# EAGLE design atx-breakout (EAGLE 9.6.2)
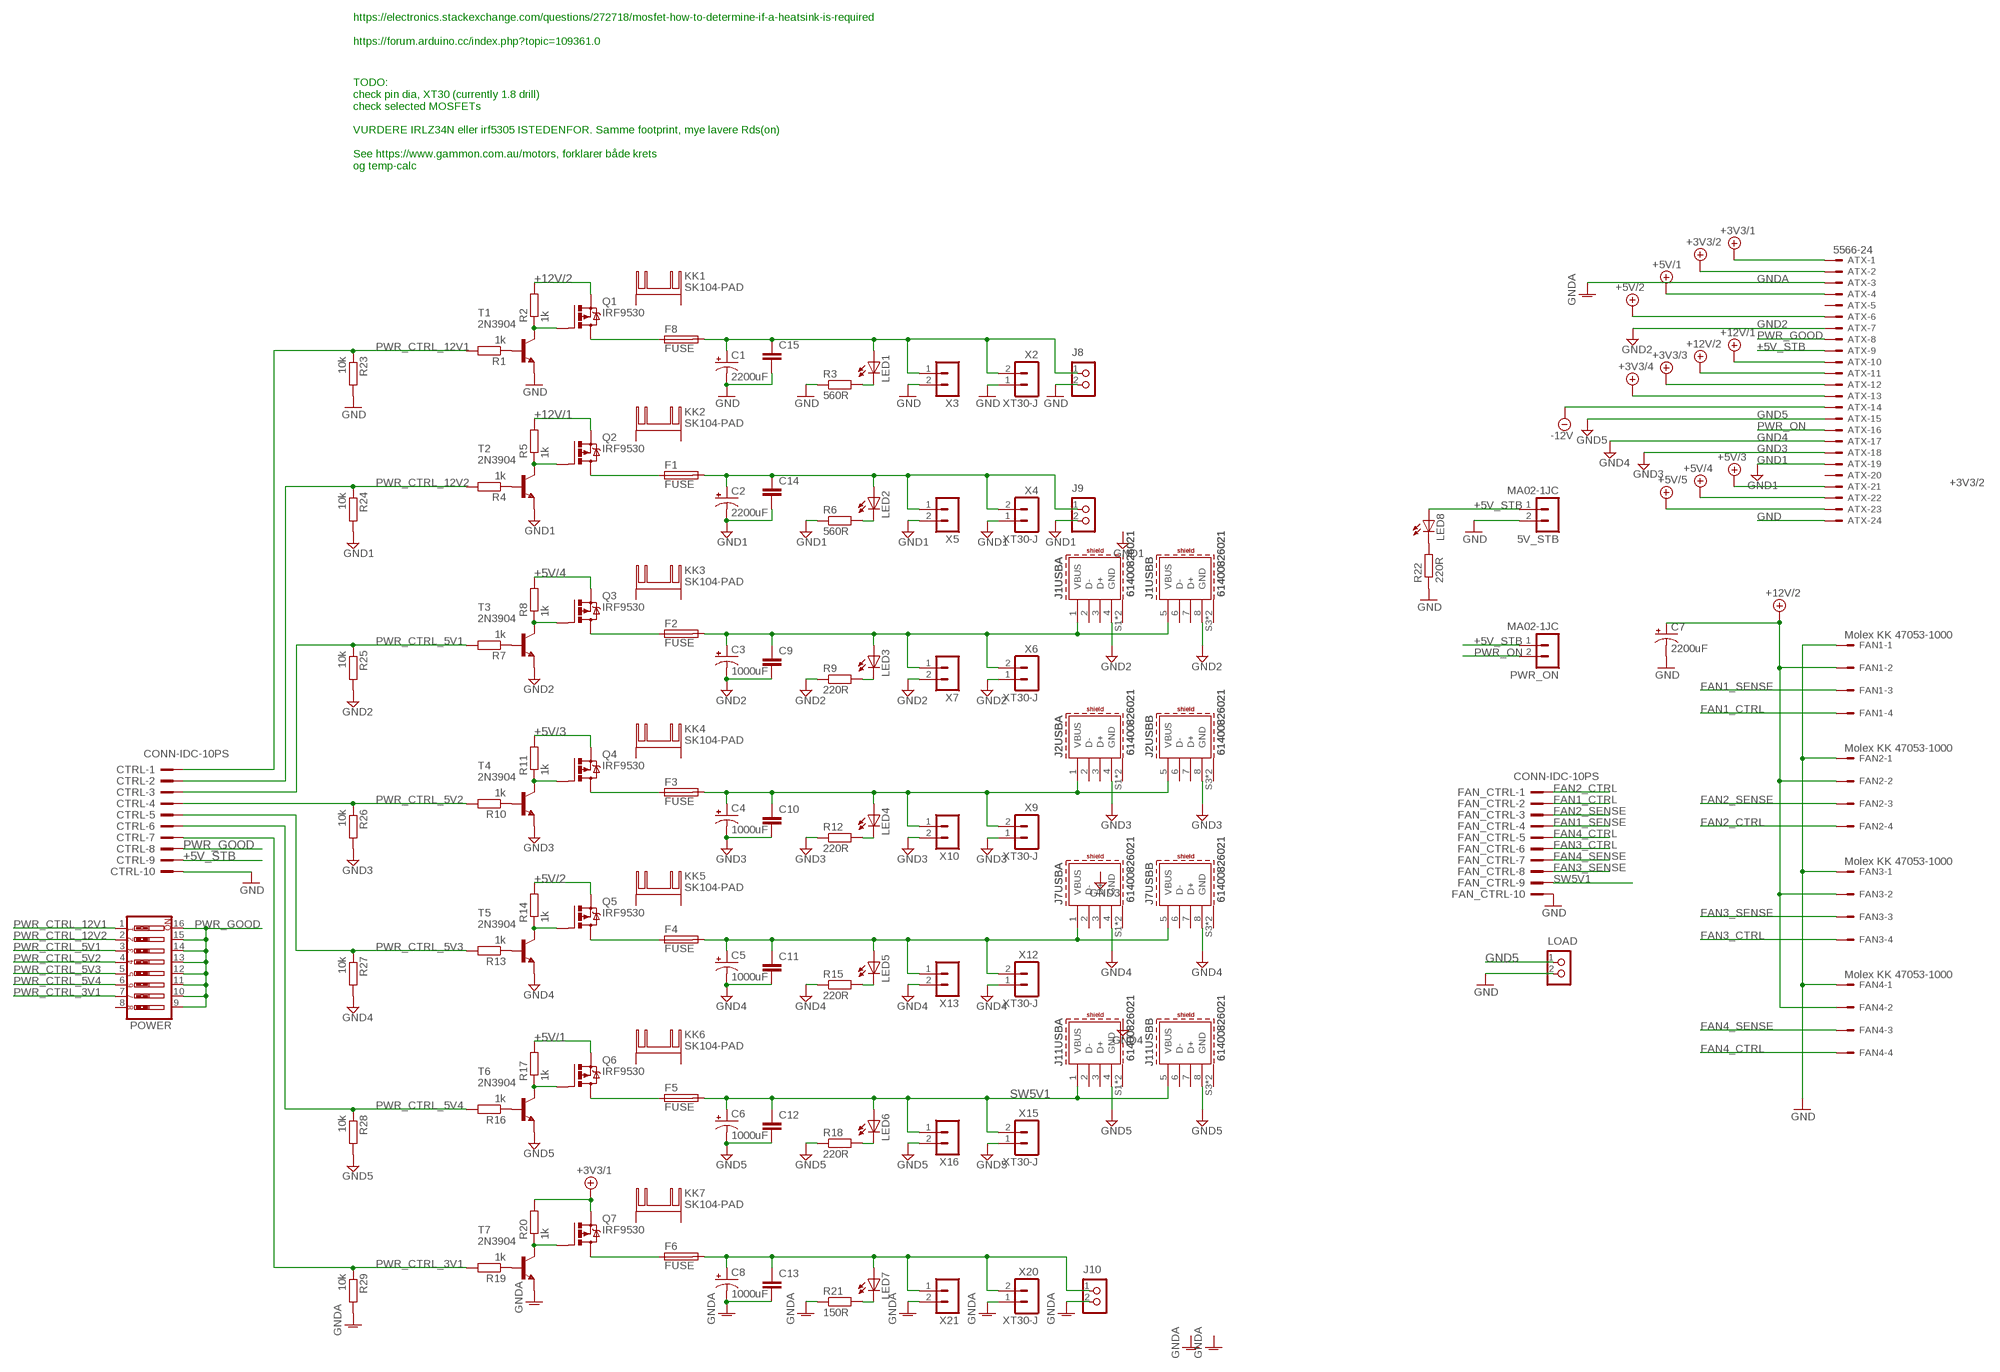
[diagram p0: schematic, sheet 1]

## Parts
5V_STB  MA02-1JC  [MA02-1J]
ATX  5566-24  [5566-24]
C1  2200uF  CPOL-USE7.5-16  [E7,5-16]
C2  2200uF  CPOL-USE7.5-16  [E7,5-16]
C3  1000uF  CPOL-USE5-10.5  [E5-10,5]
C4  1000uF  CPOL-USE5-10.5  [E5-10,5]
C5  1000uF  CPOL-USE5-10.5  [E5-10,5]
C6  1000uF  CPOL-USE5-10.5  [E5-10,5]
C7  2200uF  CPOL-USE7.5-16  [E7,5-16]
C8  1000uF  CPOL-USE5-10.5  [E5-10,5]
C9  C-EU050-030X075  [C050-030X075]
C10  C-EU050-030X075  [C050-030X075]
C11  C-EU050-030X075  [C050-030X075]
C12  C-EU050-030X075  [C050-030X075]
C13  C-EU050-030X075  [C050-030X075]
C14  C-EU050-030X075  [C050-030X075]
C15  C-EU050-030X075  [C050-030X075]
CTRL  CONN-IDC-10PS  [CONN-IDC10P-S]
F1  FUSE  FUSEBLANK_5X20MM  [FUSE_HOLDER_5X20MM]
F2  FUSE  FUSEBLANK_5X20MM  [FUSE_HOLDER_5X20MM]
F3  FUSE  FUSEBLANK_5X20MM  [FUSE_HOLDER_5X20MM]
F4  FUSE  FUSEBLANK_5X20MM  [FUSE_HOLDER_5X20MM]
F5  FUSE  FUSEBLANK_5X20MM  [FUSE_HOLDER_5X20MM]
F6  FUSE  FUSEBLANK_5X20MM  [FUSE_HOLDER_5X20MM]
F8  FUSE  FUSEBLANK_5X20MM  [FUSE_HOLDER_5X20MM]
FAN1  Molex KK 47053-1000  22-27-2041-04  [6410-04]
FAN2  Molex KK 47053-1000  22-27-2041-04  [6410-04]
FAN3  Molex KK 47053-1000  22-27-2041-04  [6410-04]
FAN4  Molex KK 47053-1000  22-27-2041-04  [6410-04]
FAN_CTRL  CONN-IDC-10PS  [CONN-IDC10P-S]
J1  61400826021  61400826021  [61400826021]
J2  61400826021  61400826021  [61400826021]
J7  61400826021  61400826021  [61400826021]
J8  CON_TERMINAL_BLOCK_02-5MM  [TERMINAL_BLOCK_2P_5]
J9  CON_TERMINAL_BLOCK_02-5MM  [TERMINAL_BLOCK_2P_5]
J10  CON_TERMINAL_BLOCK_02-5MM  [TERMINAL_BLOCK_2P_5]
J11  61400826021  61400826021  [61400826021]
KK1  SK104-PAD  [SK104-PAD]
KK2  SK104-PAD  [SK104-PAD]
KK3  SK104-PAD  [SK104-PAD]
KK4  SK104-PAD  [SK104-PAD]
KK5  SK104-PAD  [SK104-PAD]
KK6  SK104-PAD  [SK104-PAD]
KK7  SK104-PAD  [SK104-PAD]
LED1  LED_J3MM  [LED3MM]
LED2  LED_J3MM  [LED3MM]
LED3  LED_J3MM  [LED3MM]
LED4  LED_J3MM  [LED3MM]
LED5  LED_J3MM  [LED3MM]
LED6  LED_J3MM  [LED3MM]
LED7  LED_J3MM  [LED3MM]
LED8  LED_J3MM  [LED3MM]
LOAD  CON_TERMINAL_BLOCK_02-5MM  [TERMINAL_BLOCK_2P_5]
POWER  SW_DIP-8  [EDG-08]
PWR_ON  MA02-1JC  [MA02-1J]
Q1  IRF9530  [TO220BV]
Q2  IRF9530  [TO220BV]
Q3  IRF9530  [TO220BV]
Q4  IRF9530  [TO220BV]
Q5  IRF9530  [TO220BV]
Q6  IRF9530  [TO220BV]
Q7  IRF9530  [TO220BV]
R1  1k  R-EU_0207/7  [0207/7]
R2  1k  R-EU_0207/7  [0207/7]
R3  560R  R-EU_0207/7  [0207/7]
R4  1k  R-EU_0207/7  [0207/7]
R5  1k  R-EU_0207/7  [0207/7]
R6  560R  R-EU_0207/7  [0207/7]
R7  1k  R-EU_0207/7  [0207/7]
R8  1k  R-EU_0207/7  [0207/7]
R9  220R  R-EU_0207/7  [0207/7]
R10  1k  R-EU_0207/7  [0207/7]
R11  1k  R-EU_0207/7  [0207/7]
R12  220R  R-EU_0207/7  [0207/7]
R13  1k  R-EU_0207/7  [0207/7]
R14  1k  R-EU_0207/7  [0207/7]
R15  220R  R-EU_0207/7  [0207/7]
R16  1k  R-EU_0207/7  [0207/7]
R17  1k  R-EU_0207/7  [0207/7]
R18  220R  R-EU_0207/7  [0207/7]
R19  1k  R-EU_0207/7  [0207/7]
R20  1k  R-EU_0207/7  [0207/7]
R21  150R  R-EU_0207/7  [0207/7]
R22  220R  R-EU_0207/7  [0207/7]
R23  10k  R-EU_0207/7  [0207/7]
R24  10k  R-EU_0207/7  [0207/7]
R25  10k  R-EU_0207/7  [0207/7]
R26  10k  R-EU_0207/7  [0207/7]
R27  10k  R-EU_0207/7  [0207/7]
R28  10k  R-EU_0207/7  [0207/7]
R29  10k  R-EU_0207/7  [0207/7]
T1  2N3904  [TO92]
T2  2N3904  [TO92]
T3  2N3904  [TO92]
T4  2N3904  [TO92]
T5  2N3904  [TO92]
T6  2N3904  [TO92]
T7  2N3904  [TO92]
X2  XT30-J  [XT30-J]
X3  MA02-1JC  [MA02-1J]
X4  XT30-J  [XT30-J]
X5  MA02-1JC  [MA02-1J]
X6  XT30-J  [XT30-J]
X7  MA02-1JC  [MA02-1J]
X9  XT30-J  [XT30-J]
X10  MA02-1JC  [MA02-1J]
X12  XT30-J  [XT30-J]
X13  MA02-1JC  [MA02-1J]
X15  XT30-J  [XT30-J]
X16  MA02-1JC  [MA02-1J]
X20  XT30-J  [XT30-J]
X21  MA02-1JC  [MA02-1J]

## Nets
+3V3/1: ATX.1 Q7.S R20.2
+3V3/2: ATX.2
+3V3/3: ATX.12
+3V3/4: ATX.13
+5V: ATX.23 ; supply symbol labelled +5V/5
+5V/1: ATX.4 Q6.S R17.2
+5V/2: ATX.6 Q5.S R14.2
+5V/3: ATX.21 Q4.S R11.2
+5V/4: ATX.22 Q3.S R8.2
+5V_STB: 5V_STB.1 ATX.9 CTRL.9 LED8.A PWR_ON.1
+12V/1: ATX.10 Q2.S R5.2
+12V/2: ATX.11 C7.+ FAN1.2 FAN2.2 FAN3.2 FAN4.2 Q1.S R2.2
-12V: ATX.14
FAN1_CTRL: FAN1.4 FAN_CTRL.2
FAN1_SENSE: FAN1.3 FAN_CTRL.4
FAN2_CTRL: FAN2.4 FAN_CTRL.1
FAN2_SENSE: FAN2.3 FAN_CTRL.3
FAN3_CTRL: FAN3.4 FAN_CTRL.6
FAN3_SENSE: FAN3.3 FAN_CTRL.8
FAN4_CTRL: FAN4.4 FAN_CTRL.5
FAN4_SENSE: FAN4.3 FAN_CTRL.7
GND: 5V_STB.2 ATX.24 C1.- C7.- C15.2 CTRL.10 FAN1.1 FAN2.1 FAN3.1 FAN4.1 FAN_CTRL.10 J8.2 LOAD.2 R3.1 R22.1 R23.2 T1.3(E) X2.1 X3.2
GND1: ATX.19 C2.- C14.2 J9.2 R6.1 R24.2 T2.3(E) X4.1 X5.2
GND2: ATX.7 C3.- C9.2 J1.4(USBA:GND) J1.8(USBB:GND) R9.1 R25.2 T3.3(E) X6.1 X7.2
GND3: ATX.18 C4.- C10.2 J2.4(USBA:GND) J2.8(USBB:GND) R12.1 R26.2 T4.3(E) X9.1 X10.2
GND4: ATX.17 C5.- C11.2 J7.4(USBA:GND) J7.8(USBB:GND) R15.1 R27.2 T5.3(E) X12.1 X13.2
GND5: ATX.15 C6.- C12.2 J11.4(USBA:GND) J11.8(USBB:GND) LOAD.1 R18.1 R28.2 T6.3(E) X15.1 X16.2
GNDA: ATX.3 C8.- C13.2 J10.2 R21.1 R29.2 T7.3(E) X20.1 X21.2
N$1: R1.1 T1.2(B)
N$2: Q1.G R2.1 T1.1(C)
N$3: LED8.K(C) R22.2
N$4: C1.+ C15.1 F8.2 J8.1 LED1.A X2.2 X3.1
N$5: LED1.K(C) R3.2
N$6: F8.1 Q1.D
N$7: R4.1 T2.2(B)
N$8: Q2.G R5.1 T2.1(C)
N$9: C2.+ C14.1 F1.2 J9.1 LED2.A X4.2 X5.1
N$10: LED2.K(C) R6.2
N$11: F1.1 Q2.D
N$12: R7.1 T3.2(B)
N$13: Q3.G R8.1 T3.1(C)
N$14: C3.+ C9.1 F2.2 J1.1(USBA:VBUS) J1.5(USBB:VBUS) LED3.A X6.2 X7.1
N$15: LED3.K(C) R9.2
N$16: F2.1 Q3.D
N$17: R10.1 T4.2(B)
N$18: Q4.G R11.1 T4.1(C)
N$19: C4.+ C10.1 F3.2 J2.1(USBA:VBUS) J2.5(USBB:VBUS) LED4.A X9.2 X10.1
N$20: LED4.K(C) R12.2
N$21: F3.1 Q4.D
N$22: R13.1 T5.2(B)
N$23: Q5.G R14.1 T5.1(C)
N$24: C5.+ C11.1 F4.2 J7.1(USBA:VBUS) J7.5(USBB:VBUS) LED5.A X12.2 X13.1
N$25: LED5.K(C) R15.2
N$26: F4.1 Q5.D
N$27: R16.1 T6.2(B)
N$28: Q6.G R17.1 T6.1(C)
N$30: LED6.K(C) R18.2
N$31: F5.1 Q6.D
N$33: R19.1 T7.2(B)
N$34: Q7.G R20.1 T7.1(C)
N$35: C8.+ C13.1 F6.2 J10.1 LED7.A X20.2 X21.1
N$36: LED7.K(C) R21.2
N$37: F6.1 Q7.D
PWR_CTRL_3V1: CTRL.7 POWER.7 R19.2 R29.1
PWR_CTRL_5V1: CTRL.3 POWER.3 R7.2 R25.1
PWR_CTRL_5V2: CTRL.4 POWER.4 R10.2 R26.1
PWR_CTRL_5V3: CTRL.5 POWER.5 R13.2 R27.1
PWR_CTRL_5V4: CTRL.6 POWER.6 R16.2 R28.1
PWR_CTRL_12V1: CTRL.1 POWER.1 R1.2 R23.1
PWR_CTRL_12V2: CTRL.2 POWER.2 R4.2 R24.1
PWR_GOOD: ATX.8 CTRL.8 POWER.9 POWER.10 POWER.11 POWER.12 POWER.13 POWER.14 POWER.15 POWER.16
PWR_ON: ATX.16 PWR_ON.2
SW5V1: C6.+ C12.1 F5.2 FAN_CTRL.9 J11.1(USBA:VBUS) J11.5(USBB:VBUS) LED6.A X15.2 X16.1
Unconnected: ATX.5 ATX.20 J1.2(USBA:D-) J1.3(USBA:D+) J1.6(USBB:D-) J1.7(USBB:D+) J1.S1(USBA:SHIELD) J1.S2(USBA:SHIELD) J1.S3(USBB:SHIELD) J1.S4(USBB:SHIELD) J2.2(USBA:D-) J2.3(USBA:D+) J2.6(USBB:D-) J2.7(USBB:D+) J2.S1(USBA:SHIELD) J2.S2(USBA:SHIELD) J2.S3(USBB:SHIELD) J2.S4(USBB:SHIELD) J7.2(USBA:D-) J7.3(USBA:D+) J7.6(USBB:D-) J7.7(USBB:D+) J7.S1(USBA:SHIELD) J7.S2(USBA:SHIELD) J7.S3(USBB:SHIELD) J7.S4(USBB:SHIELD) J11.2(USBA:D-) J11.3(USBA:D+) J11.6(USBB:D-) J11.7(USBB:D+) J11.S1(USBA:SHIELD) J11.S2(USBA:SHIELD) J11.S3(USBB:SHIELD) J11.S4(USBB:SHIELD) KK1.K1(K) KK1.K2(K) KK2.K1(K) KK2.K2(K) KK3.K1(K) KK3.K2(K) KK4.K1(K) KK4.K2(K) KK5.K1(K) KK5.K2(K) KK6.K1(K) KK6.K2(K) KK7.K1(K) KK7.K2(K) POWER.8

## Notes on the sheet
- https://electronics.stackexchange.com/questions/272718/mosfet-how-to-determine-if-a-heatsink-is-required
  
  https://forum.arduino.cc/index.php?topic=109361.0
- TODO:
  check pin dia, XT30 (currently 1.8 drill)
  check selected MOSFETs
  
  VURDERE IRLZ34N eller irf5305 ISTEDENFOR. Samme footprint, mye lavere Rds(on)
  
  See https://www.gammon.com.au/motors, forklarer både krets 
  og temp-calc

## Library data of the parts
5V_STB PWR_ON X3 X5 X7 X10 X13 X16 X21 = joakim:MA02-1J
ATX = con-molex:5566-24: Mini FIT connector 24 pol Source: http://www.molex.com; MF: MOLEX; OC_FARNELL: unknown; OC_NEWARK: unknown
C1-C8 = rcl:CPOL-US: POLARIZED CAPACITOR, American symbol; SPICEPREFIX: C
C9-C15 = rcl:C-EU: CAPACITOR, European symbol; SPICEPREFIX: C
CTRL FAN_CTRL = joakim:CONN-IDC-10P: 10P IDC Header
F1-F6 F8 = fuse:FUSE: Fuse; OC_FARNELL: unknown; OC_NEWARK: unknown
FAN1-FAN4 = con-molex:22-?-04: CONNECTOR wire to board 2.54 mm (.1 inch) pitch header; MF: MOLEX; OC_FARNELL: unknown; OC_NEWARK: unknown
J1 J2 J7 J11 = Wurth_Connectors_WR-USB:61400826021: WR-COM USB 2.0 Type A Horizontal Dual Stacked Kind Properties Durability:1 500 Mating cycles Quality Class:1 500 Mating cycles Connector Type:USB Gender:Receptacle Type:Stacked Horizontal General Information Operating Temperature:-40up to +105 °C Compliance:RoHS Electrical Properties IR 1:1.5 A Working Voltage:30V (AC) Withstanding Voltage:750 V (AC) Contact Resistance:20 mΩ Material Properties Insulator Material:PBT Insulator Flammability Rating:UL94 V-0 Color:White Cover Material:Brass Cover Plating:Nickel Contact Material:Copper Alloy Contact Plating:Selective Gold Contact Type:Stamped Shielding Material:Brass Shielding Plating:Nickel <https://www.we-online.com/catalog/media/o32989v209%20Family_WR-COM_61400826021.jpg> Details see: https://www.we-online.com/catalog/en/COM_TYPE_A_HORIZONTAL_DUAL_STACKED/ Updated by Yingchun, Shan 2020-01-14 2020 (C) Würth Elektronik; APPLICATION: USB 2.0; DATASHEET-URL: https://www.we-online.com/catalog/datasheet/61400826021.pdf; GERDER: Receptacle; INTERFACE-TYPE: Type A; IR1: 1.5A; MOUNT: THT; PACKAGING: Tray; PART-NUMBER: 61400826021; PINS: 8; TYPE: Stacked Horizontal; WORKING-VOLTAGE: 30V(AC)
J8-J10 LOAD = dp_devices.v6:CON_TERMINAL_BLOCK_02: 2 poles wire to board terminal block
KK1-KK7 = heatsink:SK104-PAD: HEATSINK manufacturer Fischer/distributor Buerklin
LED1-LED8 = joakim:LED_J: LED Everlight: rectangular 2 x 4 mm, 594
POWER = special:SW_DIP-8: DIP SWITCH
Q1-Q7 = transistor-power:IRF9530: P-CHANNEL HEXFET POWER-MOS-FET Source: http://www.irf.com/product-info/datasheets/data/irf9530.pdf
R1-R29 = rcl:R-EU_: RESISTOR, European symbol; SPICEPREFIX: R
T1-T7 = transistor:2N3904: NPN TRANSISTOR
X2 X4 X6 X9 X12 X15 X20 = joakim:XT30-J: XT30 connector

## Board
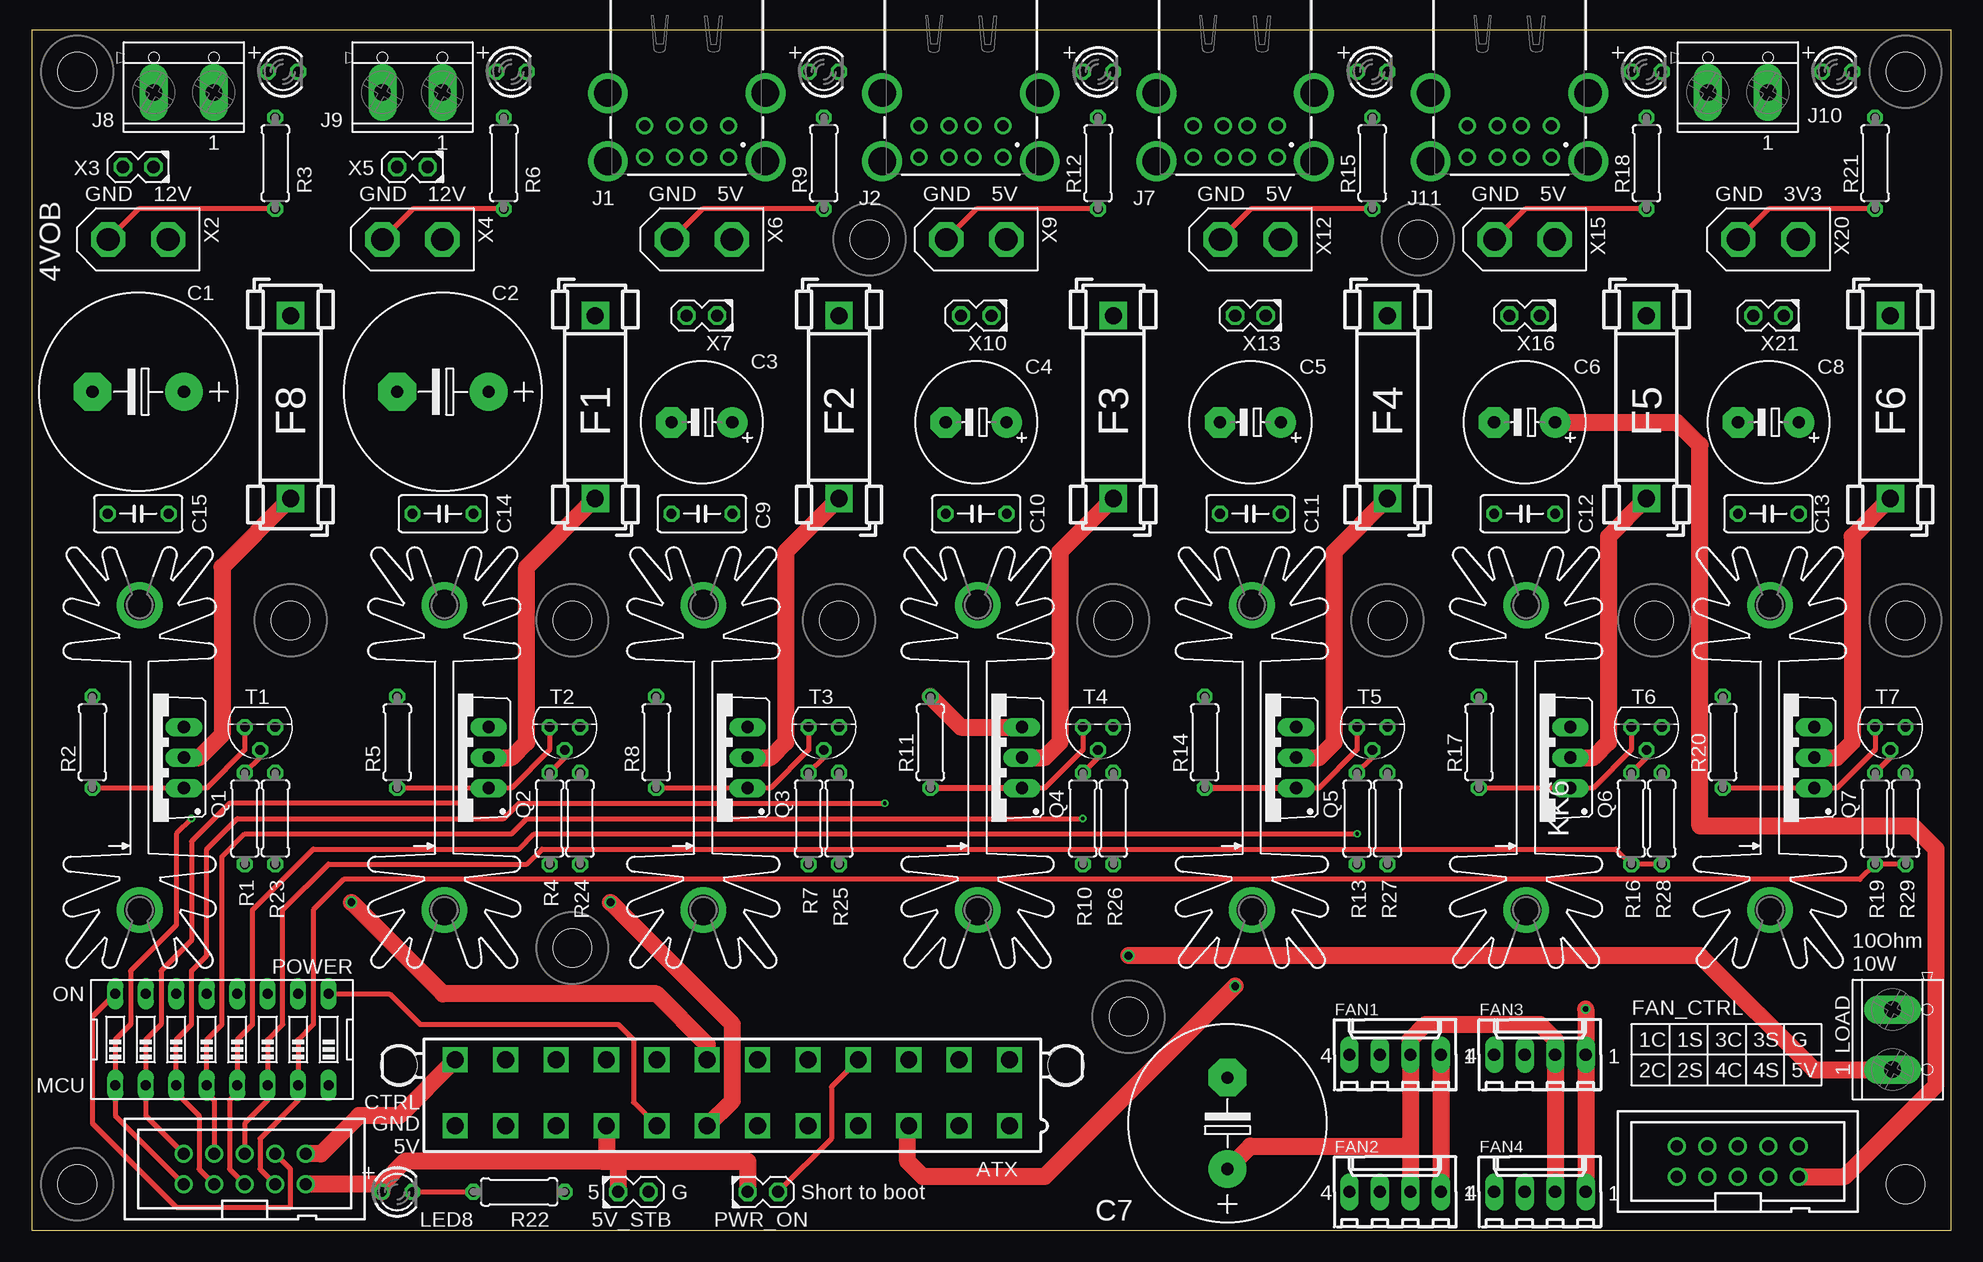
[diagram p1: board, top side]
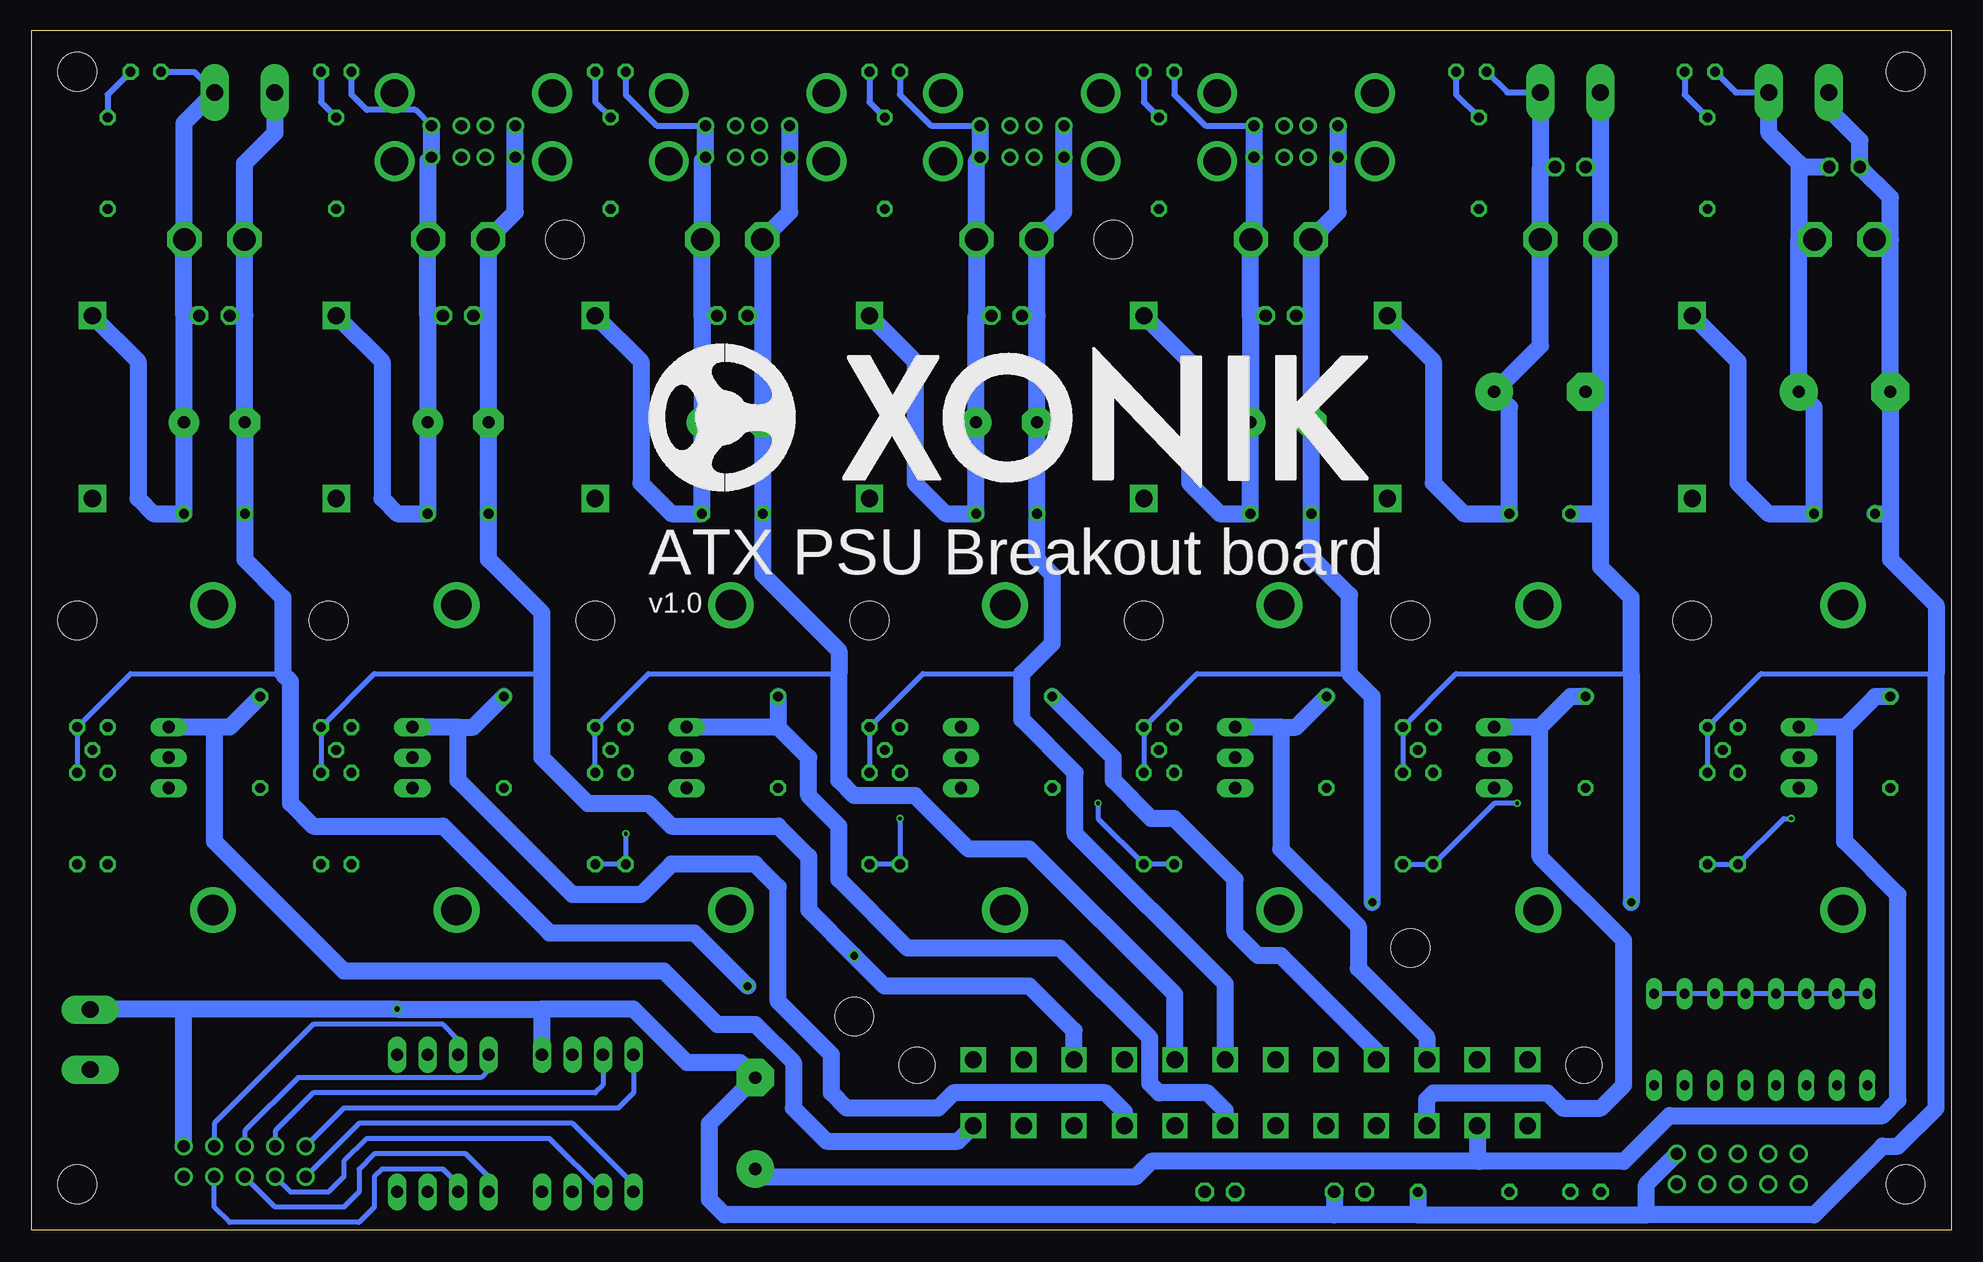
[diagram p2: board, bottom side, seen from below]

Size 160 x 100 mm. Coordinates in mm from the lower left corner, seen from the top.
Outline: 0,0 160,0 160,100 0,100 0,0
Copper layers (1*16): Top 0.035mm / dielectric 1.5mm / Bottom 0.035mm
Design rules "dirt_cheap_dirty_boards.v1.1": minimum track width 6mil, minimum drill 12mil, track to track 6mil, track to pad 6mil, pad to pad 6mil, via to via 6mil, smd to smd 0mil, copper to edge 10mil, drill to drill 10mil, minimum pad ring 10mil, minimum via ring 6mil, stop-mask expansion 2mil, vias tented up to drill 25mil, thermal gap 10mil
Holes 3.2 mm at 156.21,3.81 45.09,50.8 113.03,50.8 3.81,3.81 3.81,96.52 156.21,96.52 67.31,50.8 90.17,50.8 21.59,50.8 135.25,50.8 156.21,50.8 69.85,82.55 115.57,82.55 91.44,17.78 45.09,23.5

### Footprints (pad centres in the part's own frame; a part is rotated, then mirrored left to right if it is on the bottom)
MA02-1J = drill 1.016 octagon: 1 -2.54,0; 2 0,0
5566-24 = drill 1.4 square: 1 23.1,-2.75; 2 18.9,-2.75; 3 14.7,-2.75; 4 10.5,-2.75; 5 6.3,-2.75; 6 2.1,-2.75; 7 -2.1,-2.75; 8 -6.3,-2.75; 9 -10.5,-2.75; 10 -14.7,-2.75; 11 -18.9,-2.75; 12 -23.1,-2.75; 13 23.1,2.75; 14 18.9,2.75; 15 14.7,2.75; 16 10.5,2.75; 17 6.3,2.75; 18 2.1,2.75; 19 -2.1,2.75; 20 -6.3,2.75; 21 -10.5,2.75; 22 -14.7,2.75; 23 -18.9,2.75; 24 -23.1,2.75 | hole 3: 27.8,2.29; -27.8,2.29
E7,5-16 = drill 1.016 pad 3.15: + -3.81,0 | drill 1.016 pad 3.15 octagon: - 3.81,0
E5-10,5 = drill 1.016 pad 2.54: + -2.54,0 | drill 1.016 pad 2.54 octagon: - 2.54,0
C050-030X075 = drill 0.813 octagon: 1 -2.54,0; 2 2.54,0
CONN-IDC10P-S = drill 1 pad 1.422: 1 -5.08,-1.27; 2 -5.08,1.27; 3 -2.54,-1.27; 4 -2.54,1.27; 5 0,-1.27; 6 0,1.27; 7 2.54,-1.27; 8 2.54,1.27; 9 5.08,-1.27; 10 5.08,1.27
FUSE_HOLDER_5X20MM = drill 1.422 pad 2.286 square: 1 0,0; 2 15.24,0
6410-04 = drill 1.016 long: 1 3.81,0; 2 1.27,0; 3 -1.27,0; 4 -3.81,0
61400826021 = drill 0.92: 1 -3.5,7.11; 2 -1,7.11; 3 1,7.11; 4 3.5,7.11; 5 -3.5,4.49; 6 -1,4.49; 7 1,4.49; 8 3.5,4.49 | drill 2.3: S1 -6.57,7.46; S2 6.57,7.46; S3 -6.57,1.78; S4 6.57,1.78
TERMINAL_BLOCK_2P_5 = drill 1.4 pad 2.38 long: 1 2.5,-0.45; 2 -2.5,-0.45
SK104-PAD = drill 2.54 pad 3.81: K1 -12.7,-0.762; K2 12.7,-0.762
LED3MM = drill 0.813 octagon: A -1.27,0; K 1.27,0
EDG-08 = drill 0.813 long: 1 -8.89,-3.81; 2 -6.35,-3.81; 3 -3.81,-3.81; 4 -1.27,-3.81; 5 1.27,-3.81; 6 3.81,-3.81; 7 6.35,-3.81; 8 8.89,-3.81; 9 8.89,3.81; 10 6.35,3.81; 11 3.81,3.81; 12 1.27,3.81; 13 -1.27,3.81; 14 -3.81,3.81; 15 -6.35,3.81; 16 -8.89,3.81
TO220BV = drill 1.016 long: D 0,-2.54; G -2.54,-2.54; S 2.54,-2.54
0207/7 = drill 0.813 octagon: 1 -3.81,0; 2 3.81,0
TO92 = drill 0.813 octagon: 1 1.27,0; 2 0,1.905; 3 -1.27,0
XT30-J = drill 1.9 octagon: 1 2.5,0; 2 -2.5,0

### Placement (x,y rotation side)
5V_STB  51.44,3.17 0 top
ATX  58.42,11.43 0 top
C1  8.89,69.85 180 top
C2  34.29,69.85 180 top
C3  55.88,67.31 180 top
C4  78.74,67.31 180 top
C5  101.6,67.31 180 top
C6  124.46,67.31 180 top
C7  99.69,8.89 90 top
C8  144.78,67.31 180 top
C9  55.88,59.69 180 top
C10  78.74,59.69 180 top
C11  101.6,59.69 180 top
C12  124.46,59.69 180 top
C13  144.78,59.69 180 top
C14  34.29,59.69 180 top
C15  8.89,59.69 180 top
CTRL  17.78,5.08 0 top
F1  46.99,60.96 90 top
F2  67.31,60.96 90 top
F3  90.17,60.96 90 top
F4  113.03,60.96 90 top
F5  134.62,60.96 90 top
F6  154.94,60.96 90 top
F8  21.59,60.96 90 top
FAN1  113.67,14.61 0 top
FAN2  113.67,3.17 0 top
FAN3  125.73,14.61 0 top
FAN4  125.73,3.17 0 top
FAN_CTRL  142.24,5.71 0 top
J1  54.61,96.52 180 top
J2  77.47,96.52 180 top
J7  100.33,96.52 180 top
J8  12.7,95.25 0 top
J9  31.75,95.25 0 top
J10  142.24,95.25 0 top
J11  123.19,96.52 180 top
KK1  8.26,39.37 90 top
KK2  33.66,39.37 90 top
KK3  55.24,39.37 90 top
KK4  78.11,39.37 90 top
KK5  100.97,39.37 90 top
KK6  123.83,39.37 90 top
KK7  144.15,39.37 90 top
LED1  20.95,96.52 0 top
LED2  40.01,96.52 0 top
LED3  66.04,96.52 0 top
LED4  88.9,96.52 0 top
LED5  111.76,96.52 0 top
LED6  134.62,96.52 0 top
LED7  150.5,96.52 0 top
LED8  30.48,3.17 0 top
LOAD  155.57,15.88 270 top
POWER  15.88,15.88 0 top
PWR_ON  62.23,3.17 0 top
Q1  10.16,39.37 90 top
Q2  35.56,39.37 90 top
Q3  57.15,39.37 90 top
Q4  80.01,39.37 90 top
Q5  102.87,39.37 90 top
Q6  125.73,39.37 90 top
Q7  146.05,39.37 90 top
R1  17.78,34.29 270 top
R2  5.08,40.64 90 top
R3  20.32,88.9 90 top
R4  43.18,34.29 270 top
R5  30.48,40.64 90 top
R6  39.37,88.9 90 top
R7  64.77,34.29 270 top
R8  52.07,40.64 90 top
R9  66.04,88.9 90 top
R10  87.63,34.29 270 top
R11  74.93,40.64 90 top
R12  88.9,88.9 90 top
R13  110.49,34.29 270 top
R14  97.79,40.64 90 top
R15  111.76,88.9 90 top
R16  133.35,34.29 270 top
R17  120.65,40.64 90 top
R18  134.62,88.9 90 top
R19  153.67,34.29 270 top
R20  140.97,40.64 90 top
R21  153.67,88.9 90 top
R22  40.64,3.17 180 top
R23  20.32,34.29 90 top
R24  45.72,34.29 90 top
R25  67.31,34.29 90 top
R26  90.17,34.29 90 top
R27  113.03,34.29 90 top
R28  135.89,34.29 90 top
R29  156.21,34.29 90 top
T1  19.05,41.91 180 top
T2  44.45,41.91 180 top
T3  66.04,41.91 180 top
T4  88.9,41.91 180 top
T5  111.76,41.91 180 top
T6  134.62,41.91 180 top
T7  154.94,41.91 180 top
U$1  [XONIK_LOGO_60]  108.58,61.59 0 bottom
X2  8.89,82.55 180 top
X3  7.62,88.58 180 top
X4  31.75,82.55 180 top
X5  30.48,88.58 180 top
X6  55.88,82.55 180 top
X7  54.61,76.2 180 top
X9  78.74,82.55 180 top
X10  77.47,76.2 180 top
X12  101.6,82.55 180 top
X13  100.33,76.2 180 top
X15  124.46,82.55 180 top
X16  123.19,76.2 180 top
X20  144.78,82.55 180 top
X21  143.51,76.2 180 top

### Tracks (layer width: path | path; a pad name or v marks a point on that pad's centre or on a via)
+3V3/1
  Bottom 1.397: 144.78,41.91 144.78,32.38 133.99,21.59 107.31,21.59 102.87,17.14 99.69,17.14 96.52,13.97 96.52,10.16 93.77,7.41 82.79,7.41 ATX.1 | R20.2 143.51,41.91 144.78,41.91 | 144.78,41.91 Q7.S
+5V/1
  Bottom 1.397: 124.46,41.91 123.19,41.91 R17.2 | 124.46,41.91 Q6.S | 124.46,41.91 124.46,37.47 114.94,27.94 109.22,27.94 106.68,30.48 99.69,30.48 97.79,28.57 97.79,19.05 93.34,14.61 93.34,11.43 92.08,10.16 84.45,10.16 83.19,11.43 70.48,11.43 68.92,9.87 ATX.4
+5V/2
  Bottom 1.397: ATX.6 60.52,9.95 62,11.43 66.04,11.43 66.8,12.19 66.8,16 74.3,23.5 87,23.5 92.71,29.21 92.71,33.66 95.25,36.2 95.25,39.37 97.79,41.91 | 97.79,41.91 Q5.S | R14.2 97.79,41.91
+5V/3
  Top 1.397: R11.2 77.47,41.91 Q4.S
  Bottom 1.397: R11.2 69.85,39.37 69.85,37.47 66.67,34.29 64.77,34.29 59.69,29.21 59.69,24.77 57.78,22.86 55.88,22.86 47.92,14.9 ATX.21
+5V/4
  Bottom 1.397: 55.88,41.91 54.61,41.91 R8.2 | 55.88,41.91 55.88,31.75 49.44,25.3 49.44,21.8 43.72,16.09 ATX.22 | 55.88,41.91 Q3.S
+5V_STB
  Top 1.397: PWR_ON.1 59.69,5.71 48.9,5.71 | 47.62,5.71 48.9,5.71 | ATX.9 47.92,6.01 47.62,5.71 | LED8.A 29.21,3.81 | 29.21,3.81 CTRL.9 | 29.21,3.81 31.11,5.71 47.62,5.71 | 48.9,5.71 5V_STB.1
+12V/1
  Bottom 1.397: R5.2 31.75,44.45 34.29,41.91 | 34.29,41.91 Q2.S | 34.29,41.91 34.29,31.11 27.3,24.13 27.3,12.06 29.21,10.16 32.38,10.16 33.66,11.43 43.18,11.43 43.72,10.89 ATX.10
+12V/2
  Top 1.397: 114.94,6.99 FAN1.2 114.94,15.88 116.2,17.14 125.73,17.14 127,15.88 FAN3.2 FAN4.2 | 114.94,6.99 FAN2.2 | C7.+ 101.6,6.99 114.94,6.99
  Bottom 1.397: R2.2 6.35,44.45 8.89,41.91 | 8.89,41.91 Q1.S | 8.89,41.91 8.89,32.38 4.45,27.94 4.45,10.79 5.71,9.53 23.5,9.53 27.3,5.71 39.37,5.71 | C7.+ 99.06,4.45 67.94,4.45 66.67,5.71 39.37,5.71 | ATX.11 39.52,5.87 39.37,5.71
FAN1_CTRL
  Bottom 0.406: FAN1.4 109.86,11.43 111.12,10.16 133.99,10.16 FAN_CTRL.2
FAN1_SENSE
  Bottom 0.406: FAN1.3 112.39,12.06 113.03,11.43 136.53,11.43 139.7,8.26 FAN_CTRL.4
FAN2_CTRL
  Bottom 0.406: FAN2.4 109.86,3.81 114.94,8.89 132.72,8.89 FAN_CTRL.1
FAN2_SENSE
  Bottom 0.406: FAN2.3 116.84,7.62 132.08,7.62 133.99,5.71 133.99,4.45 135.25,3.17 138.43,3.17 FAN_CTRL.3
FAN3_CTRL
  Bottom 0.406: FAN3.4 121.92,13.34 122.56,12.7 137.79,12.7 142.24,8.26 FAN_CTRL.6
FAN3_SENSE
  Bottom 0.406: FAN3.3 124.46,15.88 125.73,17.14 136.53,17.14 144.78,8.89 FAN_CTRL.8
FAN4_CTRL
  Bottom 0.406: FAN4.4 121.92,4.45 123.83,6.35 131.44,6.35 132.72,5.08 132.72,3.17 133.99,1.91 139.7,1.91 FAN_CTRL.5
FAN4_SENSE
  Bottom 0.406: FAN4.3 124.46,3.81 125.73,5.08 130.81,5.08 131.44,4.45 131.44,1.91 132.72,0.64 143.51,0.64 144.78,1.91 FAN_CTRL.7
GND  (via drill 0.45)
  Top 0.406: R3.1 8.93,85.09 X2.1
  Top 1.397: FAN1.1 FAN2.1 | FAN4.1 FAN3.1 v129.54,18.41 | ATX.24 30.66,9.53 27.3,9.53 24.13,6.35 CTRL.10
  Bottom 0.406: 1.27,46.35 15.88,46.35 T1.3 R23.2
  Bottom 1.397: 5.08,59.69 C1.- 5.08,82.55 | 5.08,59.69 5.08,55.88 1.27,52.07 1.27,46.35 1.27,10.16 4.45,6.99 5.71,6.99 11.43,1.27 25.4,1.27 | FAN_CTRL.10 147.32,18.41 | FAN1.1 117.47,18.41 | 117.47,18.41 v129.54,18.41 147.32,18.41 | 5.08,82.55 X2.1 | 5.08,82.55 5.08,86.04 X3.2 7.62,90.81 10.2,93.39 J8.2 | 117.47,18.41 109.86,18.41 105.41,13.97 100.97,13.97 C7.- 103.5,8.89 103.5,2.54 102.23,1.27 51.44,1.27 | CTRL.10 25.4,3.81 25.4,1.27 | 44.45,1.27 51.44,1.27 | R22.1 44.45,1.27 | 44.45,1.27 25.4,1.27 | 5V_STB.2 51.44,1.27 | C15.2 5.08,59.69 | 147.32,18.41 155.09,18.41 LOAD.2
GND1  (via drill 0.65)
  Top 0.406: R6.1 31.79,85.09 X4.1
  Top 1.397: ATX.19 56.32,15.45 52.09,19.68 34.29,19.68 v26.67,27.3
  Bottom 0.406: 26.67,46.35 41.27,46.35 T2.3 R24.2
  Bottom 1.397: J9.2 29.25,88.58 | 29.25,88.58 X4.1 29.21,82.51 29.21,69.85 | X5.2 29.25,88.58 | C2.- 29.21,69.85 | 29.21,59.69 29.21,55.24 26.67,52.7 26.67,46.35 v26.67,27.3 | 29.21,59.69 29.21,69.85 | C14.2 29.21,59.69
GND2  (via drill 0.65)
  Top 0.406: R9.1 55.92,85.09 X6.1
  Top 1.397: ATX.7 58.42,10.78 58.42,17.14 v48.26,27.3
  Bottom 0.406: 50.16,46.35 62.87,46.35 T3.3 R25.2
  Bottom 1.397: v48.26,27.3 48.26,44.45 50.16,46.35 50.16,52.91 53.34,56.08 C9.2 C3.- 53.34,76.2 | 53.34,76.2 53.34,82.51 X6.1 51.11,84.82 J1.4 J1.8 | X7.2 53.34,76.2
GND3
  Top 0.406: R12.1 78.78,85.09 X9.1
  Bottom 0.406: R26.2 T4.3 85.72,46.35 77.47,46.35
  Bottom 1.397: ATX.18 60.52,20.52 73.03,33.02 73.03,38.1 77.47,42.55 77.47,46.35 74.93,48.9 74.93,54.61 76.2,55.88 C10.2 C4.- 76.2,76.2 | 76.2,76.2 X10.2 | 76.2,76.2 76.2,82.51 X9.1 73.97,84.82 J2.4 J2.8
GND4
  Top 0.406: R15.1 101.64,85.09 X12.1
  Bottom 0.406: R27.2 T5.3 108.58,46.35 92.71,46.35
  Bottom 1.397: 99.06,76.2 C5.- C11.2 99.06,54.61 92.71,48.26 92.71,46.35 92.71,37.47 91.44,36.2 86.36,36.2 81.92,31.75 76.83,31.75 64.72,19.64 ATX.17 | 99.06,76.2 X13.2 | 99.06,76.2 99.06,82.51 X12.1 96.83,84.82 J7.4 J7.8
GND5  (via drill 0.65)
  Top 0.406: R18.1 124.5,85.09 X15.1
  Top 1.397: v91.44,22.86 139.06,22.86 148.59,13.34 155.09,13.34 LOAD.1
  Bottom 0.406: 117.47,46.35 131.44,46.35 T6.3 R28.2
  Bottom 1.397: ATX.15 73.12,16.61 76.83,20.32 88.9,20.32 v91.44,22.86 95.25,26.67 95.25,31.11 97.79,33.66 106.68,33.66 108.58,35.56 113.67,35.56 117.47,39.37 117.47,46.35 117.47,51.44 121.92,55.88 C12.2 C6.- 121.92,76.2 | 121.92,76.2 X16.2 | 121.92,76.2 121.92,82.51 X15.1 119.69,84.82 J11.4 J11.8
GNDA  (via drill 0.65)
  Top 0.406: R21.1 144.82,85.09 X20.1
  Top 1.397: v100.33,20.32 84.45,4.45 74.3,4.45 73.03,5.71 73.03,8.59 ATX.3
  Bottom 0.406: 139.06,46.35 151.76,46.35 T7.3 R29.2
  Bottom 1.397: J10.2 139.74,91.4 142.28,88.86 X20.1 142.24,82.51 142.24,76.2 | 142.24,76.2 C8.- C13.2 142.24,55.88 139.06,52.7 139.06,46.35 138.43,45.72 138.43,35.56 136.53,33.66 125.73,33.66 116.84,24.77 104.78,24.77 v100.33,20.32 | X21.2 142.24,76.2
N$1
  Top 0.406: T1.2 19.05,39.37 R1.1
N$2
  Top 0.406: T1.1 17.78,40.01 14.61,36.83 Q1.G R2.1
N$3
  Top 0.406: LED8.K R22.2
N$4
  Bottom 0.508: LED1.A 17.96,94.8 J8.1
  Bottom 1.397: 12.7,82.55 C1.+ 11.43,68.58 C15.1 15.24,59.69 17.78,62.23 17.78,72.39 F8.2 | 12.7,82.55 X2.2 | X3.1 12.7,88.58 | 12.7,88.58 12.7,88.9 15.2,91.4 J8.1 | 12.7,88.58 12.7,82.55
N$5
  Bottom 0.508: LED1.K 22.23,94.61 R3.2
N$6
  Top 1.397: Q1.D 13.97,39.37 15.88,41.27 15.88,55.24 F8.1
N$7
  Top 0.406: T2.2 44.45,39.37 R4.1
N$8
  Top 0.406: T2.1 43.18,40.01 40.01,36.83 Q2.G R5.1
N$9
  Bottom 0.152: 34.25,88.86 33.97,88.58 X5.1
  Bottom 0.508: LED2.A 37.02,94.8 J9.1
  Bottom 1.397: X5.1 34.25,88.58 X4.2 34.25,73.7 C2.+ 36.83,68.58 C14.1 40.64,59.69 43.18,62.23 43.18,72.39 F1.2 | J9.1 34.25,88.86
N$10
  Bottom 0.508: LED2.K 41.27,94.61 R6.2
N$11
  Top 1.397: Q2.D 40.01,39.37 41.27,40.64 41.27,55.24 F1.1
N$12
  Top 0.406: T3.2 66.04,39.37 R7.1
N$13
  Top 0.406: T3.1 64.77,40.01 61.59,36.83 Q3.G R8.1
N$14
  Bottom 0.508: LED3.A 64.77,94.61 62.19,92.03 J1.5
  Bottom 1.397: F2.2 63.5,72.39 63.5,62.23 60.96,59.69 C9.1 C3.+ 58.42,76.2 | X7.1 58.42,76.2 | 58.42,76.2 58.42,82.51 X6.2 58.11,82.82 J1.1 J1.5
N$15
  Bottom 0.508: LED3.K 67.31,93.98 R9.2
N$16
  Top 1.397: F2.1 62.87,56.52 62.87,40.64 61.59,39.37 Q3.D
N$17
  Top 0.406: T4.2 88.9,39.37 R10.1
N$18
  Top 0.406: T4.1 87.63,40.01 84.45,36.83 Q4.G
  Top 0.508: Q4.G R11.1
N$19
  Bottom 0.508: LED4.A 87.63,94.61 85.05,92.03 J2.5
  Bottom 1.397: F3.2 86.36,72.39 86.36,62.23 83.82,59.69 C10.1 C4.+ 81.28,76.2 | X10.1 81.28,76.2 | J2.5 J2.1 81.24,89.14 X9.2 81.24,76.24 81.28,76.2
N$20
  Bottom 0.508: LED4.K 90.17,93.98 R12.2
N$21
  Top 1.397: Q4.D 84.45,39.37 85.72,40.64 85.72,56.52 F3.1
N$22
  Top 0.406: T5.2 111.76,39.37 R13.1
N$23
  Top 0.406: T5.1 110.49,40.01 107.31,36.83 Q5.G
  Top 0.508: Q5.G R14.1
N$24
  Bottom 0.508: LED5.A 110.49,94.61 107.91,92.03 J7.5
  Bottom 1.397: F4.2 109.22,72.39 109.22,62.23 106.68,59.69 C11.1 C5.+ 104.14,76.2 | X13.1 104.14,76.2 | 104.14,76.2 104.14,82.51 X12.2 104.1,89.14 J7.1 J7.5
N$25
  Bottom 0.508: LED5.K 113.03,93.98 R15.2
N$26
  Top 1.397: Q5.D 107.31,39.37 108.58,40.64 108.58,56.52 F4.1
N$27
  Top 0.406: T6.2 134.62,39.37 R16.1
N$28
  Top 0.406: T6.1 133.35,40.01 130.18,36.83 Q6.G R17.1
N$30
  Bottom 0.508: LED6.K 135.89,93.98 R18.2
N$31
  Top 1.397: Q6.D 130.18,39.37 131.44,40.64 131.44,57.78 F5.1
N$33
  Top 0.406: T7.2 154.94,39.37 R19.1
N$34
  Top 0.406: T7.1 153.67,40.01 150.5,36.83 Q7.G R20.1
N$35
  Bottom 0.508: LED7.A 146.46,96.52 J10.1
  Bottom 1.397: F6.2 151.13,72.39 151.13,60.96 149.86,59.69 C13.1 C8.+ 147.32,76.2 | X21.1 147.32,76.2 | 147.32,76.2 147.32,82.51 | 147.32,82.51 X20.2 | J10.1 147.32,92.22 147.32,82.51
N$36
  Bottom 0.508: LED7.K 153.67,94.61 R21.2
N$37
  Top 1.397: Q7.D 150.5,39.37 151.76,40.64 151.76,57.78 F6.1
PWR_CTRL_3V1
  Top 0.406: CTRL.7 19.05,5.08 19.05,7.62 22.23,10.79 POWER.7 22.23,15.88 23.5,17.14 23.5,26.67 26.04,29.21 152.4,29.21 R19.2 R29.1
PWR_CTRL_5V1  (via drill 0.3)
  Top 0.406: CTRL.3 13.97,5.08 13.97,9.53 12.06,11.43 POWER.3 12.06,15.88 13.34,17.14 13.34,21.59 14.61,22.86 14.61,31.75 17.14,34.29 39.37,34.29 40.64,35.56 v71.12,35.56
  Bottom 0.406: v71.12,35.56 71.12,34.29 R25.1 R7.2
PWR_CTRL_5V2  (via drill 0.3)
  Top 0.406: CTRL.4 15.24,10.79 14.61,11.43 POWER.4 14.61,15.88 15.88,17.14 15.88,31.11 17.78,33.02 40.01,33.02 41.27,34.29 v87.63,34.29
  Bottom 0.406: v87.63,34.29 R10.2 R26.1
PWR_CTRL_5V3  (via drill 0.3)
  Top 0.406: CTRL.5 16.51,5.08 16.51,10.79 17.14,11.43 POWER.5 17.14,15.88 18.41,17.14 18.41,26.67 23.5,31.75 40.64,31.75 41.91,33.02 v110.49,33.02
  Bottom 0.406: v110.49,33.02 R13.2 R27.1
PWR_CTRL_5V4
  Top 0.406: CTRL.6 17.78,8.89 19.68,10.79 POWER.6 19.68,15.88 20.95,17.14 20.95,26.67 24.77,30.48 41.27,30.48 42.55,31.75 132.08,31.75 R16.2 R28.1
PWR_CTRL_12V1  (via drill 0.3)
  Top 0.406: CTRL.1 6.99,9.53 POWER.1 6.99,15.88 8.26,17.14 8.26,21.59 12.06,25.4 12.06,33.02 v13.34,34.29
  Bottom 0.406: R23.1 R1.2 13.97,34.29 v13.34,34.29
PWR_CTRL_12V2  (via drill 0.3)
  Top 0.406: CTRL.2 9.53,9.53 POWER.2 9.53,15.88 10.79,17.14 10.79,21.59 13.34,24.13 13.34,32.38 16.51,35.56 v36.2,35.56
  Bottom 0.406: R24.1 R4.2 38.1,35.56 v36.2,35.56
PWR_GOOD
  Top 0.406: POWER.16 5.08,17.78 5.08,8.89 12.06,1.91 21.59,1.91 21.59,5.08 CTRL.8 | POWER.9 29.84,19.68 32.38,17.14 48.9,17.14 50.16,15.88 50.16,10.63 ATX.8
  Bottom 0.406: POWER.16 POWER.15 POWER.14 POWER.13 POWER.12 POWER.11 POWER.10 POWER.9
PWR_ON
  Top 0.406: ATX.16 66.67,11.94 66.67,7.62 PWR_ON.2
SW5V1
  Top 1.397: C6.+ 137.16,67.31 139.06,65.41 139.06,33.66 156.84,33.66 158.75,31.75 158.75,12.06 151.13,4.45 FAN_CTRL.9
  Bottom 0.508: J11.5 128,93.34 132.08,93.34 133.35,94.61 LED6.A
  Bottom 1.397: F5.2 130.81,72.39 130.81,60.96 129.54,59.69 C12.1 C6.+ 127,76.2 | X16.1 127,76.2 | 127,76.2 127,82.51 X15.2 126.96,89.14 J11.1 J11.5

### Text on the board
tNames: 4VOB | GND | 12V | GND | 12V | GND | 5V | GND | 5V | GND | 5V | GND | 5V | GND | 3V3 | 10Ohm / 10W | ON | 1C | 1S | 3C | 3S | G | MCU | 2C | 2S | 4C | 4S | 5V | GND | 5V | 5 | G | Short to boot
bNames: ATX PSU Breakout board | v1.0